# EAGLE design DAC (EAGLE 5.07)
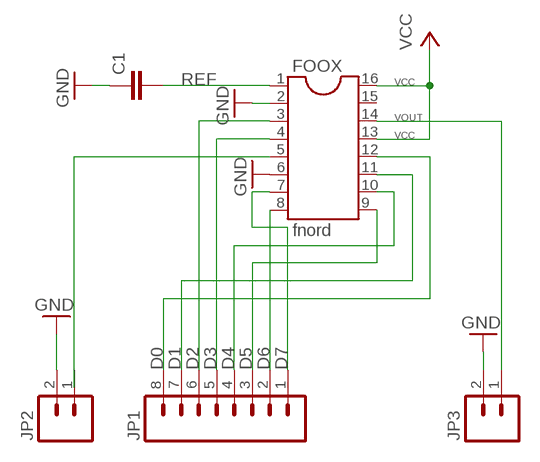
[diagram p0: schematic, sheet 1]

## Parts
C1  CAPPTH  [CAP-PTH-SMALL]
FOOX  fnord  DIL16  [DIL16]
JP1  M08  [1X08]
JP2  M02PTH  [1X02]
JP3  M02PTH  [1X02]

## Nets
D0: FOOX.12 JP1.8
D1: FOOX.11 JP1.7
D2: FOOX.3 JP1.6
D3: FOOX.4 JP1.5
D4: FOOX.10 JP1.4
D5: FOOX.9 JP1.3
D6: FOOX.8 JP1.2
D7: FOOX.7 JP1.1
GND: C1.1 FOOX.2 FOOX.6 JP2.2 JP3.2
N$2: FOOX.5
REF: C1.2 FOOX.1
VCC: FOOX.13 FOOX.16
VOUT: FOOX.14 JP3.1
Unconnected: FOOX.15 JP2.1

## Library data of the parts
C1 = SparkFun:CAP: Capacitor Standard 0603 ceramic capacitor, and 0.1" leaded capacitor.
FOOX = ic-package:DIL16: Dual In Line / Socket
JP1 = SparkFun:M08: Header 8 Standard 8-pin 0.1" header. Use with straight break away headers (SKU : PRT-00116), right angle break away headers (PRT-00553), swiss pins (PRT-00743), machine pins (PRT-00117), and female headers (PRT-00115).
JP2 JP3 = SparkFun:M02: Header 2 Standard 2-pin 0.1" header. Use with straight break away headers (SKU : PRT-00116), right angle break away headers (PRT-00553), swiss pins (PRT-00743), machine pins (PRT-00117), and female headers (PRT-00115). Molex polarized connector foot print use with SKU : PRT-08233 with associated crimp pins and housings.

## Board
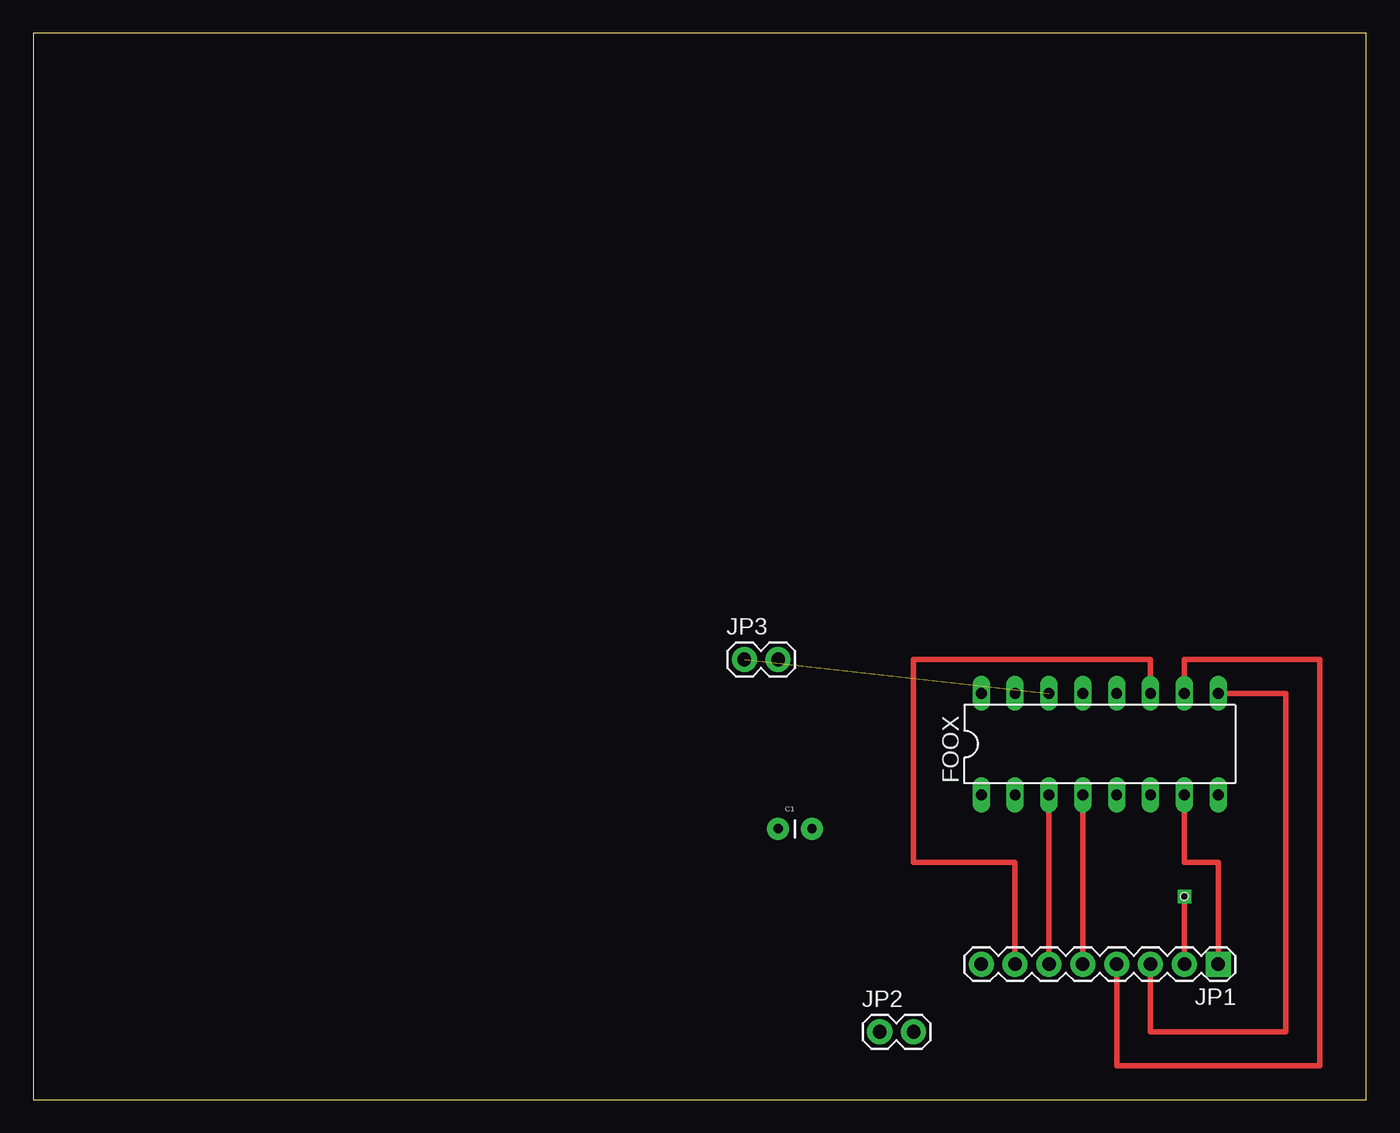
[diagram p1: board, top side]
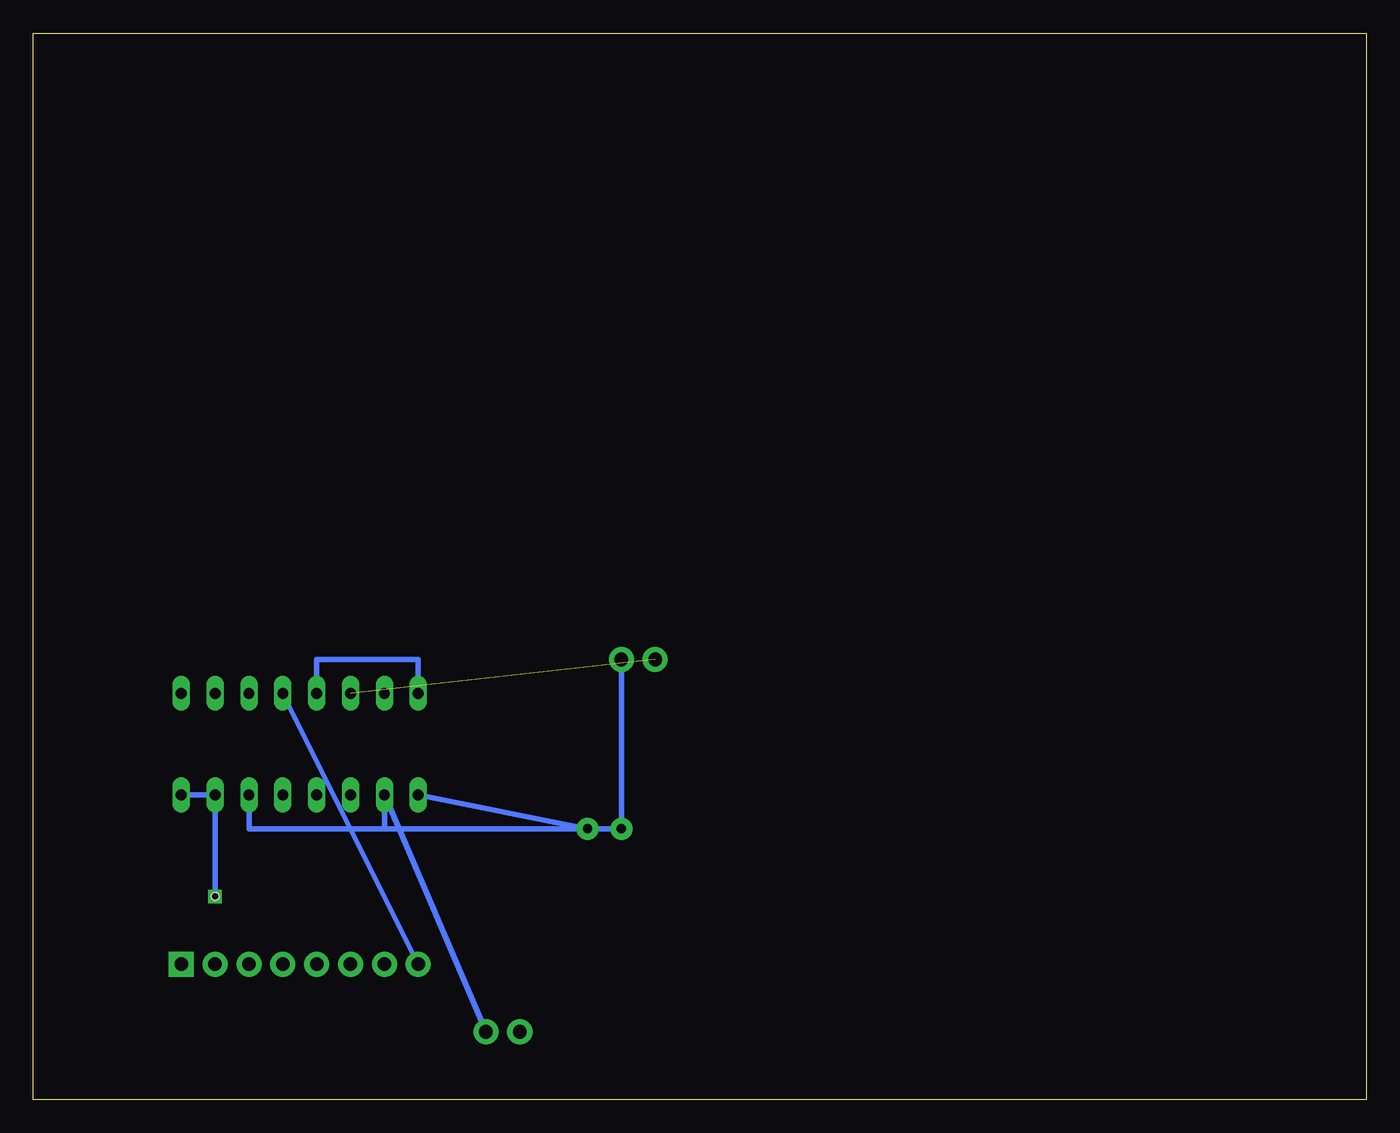
[diagram p2: board, bottom side, seen from below]

Size 100 x 80 mm. Coordinates in mm from the lower left corner, seen from the top.
Outline: 0,0 100,0 100,80 0,80 0,0
Copper layers (1*16): Top 0.035mm / dielectric 1.5mm / Bottom 0.035mm
Design rules "default *": minimum track width 10mil, minimum drill 24mil, track to track 8mil, track to pad 8mil, pad to pad 8mil, via to via 8mil, smd to smd 8mil, copper to edge 40mil, drill to drill 8mil, minimum pad ring 10mil, minimum via ring 8mil, stop-mask expansion 4mil, vias tented up to drill 0mil, thermal gap 10mil
Holes 0.6 mm at 86.36,15.24

### Footprints (pad centres in the part's own frame; a part is rotated, then mirrored left to right if it is on the bottom)
CAP-PTH-SMALL = drill 0.7 pad 1.651 round: 1 0,0; 2 2.54,0
DIL16 = drill 0.813 long: 1 -8.89,-3.81; 2 -6.35,-3.81; 3 -3.81,-3.81; 4 -1.27,-3.81; 5 1.27,-3.81; 6 3.81,-3.81; 7 6.35,-3.81; 8 8.89,-3.81; 9 8.89,3.81; 10 6.35,3.81; 11 3.81,3.81; 12 1.27,3.81; 13 -1.27,3.81; 14 -3.81,3.81; 15 -6.35,3.81; 16 -8.89,3.81
1X08 = drill 1.016 pad 1.88 square: 1 0,0 | drill 1.016 pad 1.88 round: 2 2.54,0; 3 5.08,0; 4 7.62,0; 5 10.16,0; 6 12.7,0; 7 15.24,0; 8 17.78,0
1X02 = drill 1.016 pad 1.88 round: 1 0,0; 2 2.54,0

### Placement (x,y rotation side)
C1  55.88,20.32 0 top
FOOX  80.01,26.67 0 top
JP1  88.9,10.16 180 top
JP2  63.5,5.08 0 top
JP3  53.34,33.02 0 top

### Tracks (layer width: path | path; a pad name or v marks a point on that pad's centre or on a via)
D0
  Bottom 0.406: JP1.8 FOOX.12
D1
  Top 0.406: FOOX.11 83.82,33.02 66.04,33.02 66.04,17.78 73.66,17.78 JP1.7
D2
  Top 0.406: JP1.6 FOOX.3
D3
  Top 0.406: JP1.5 FOOX.4
D4
  Top 0.406: FOOX.10 86.36,33.02 96.52,33.02 96.52,2.54 81.28,2.54 JP1.4
D5
  Top 0.406: FOOX.9 93.98,30.48 93.98,5.08 83.82,5.08 JP1.3
D6  (1 unrouted)
  Top 0.406: JP1.2 86.36,15.24
  Bottom 0.406: FOOX.8 86.36,22.86 86.36,15.24
D7
  Top 0.406: FOOX.7 86.36,17.78 88.9,17.78 JP1.1
GND
  Bottom 0.406: 73.66,20.32 FOOX.2 JP2.2 | 73.66,20.32 83.82,20.32 FOOX.6 | JP3.2 C1.1 73.66,20.32
N$1  (via drill 0.6)
  other vias: 86.36,15.24
REF
  Bottom 0.406: C1.2 FOOX.1
VCC
  Bottom 0.406: FOOX.13 78.74,33.02 71.12,33.02 FOOX.16
VOUT  (1 unrouted)